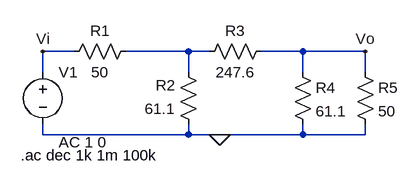
[diagram p0: schematic ej1.asc]
ej1.asc, the LTspice schematic file:
Version 4
SHEET 1 880 680
WIRE 48 64 0 64
WIRE 224 64 128 64
WIRE 256 64 224 64
WIRE 400 64 336 64
WIRE 496 64 400 64
WIRE 0 96 0 64
WIRE 224 96 224 64
WIRE 400 96 400 64
WIRE 496 96 496 64
WIRE 0 192 0 176
WIRE 224 192 224 176
WIRE 224 192 0 192
WIRE 272 192 224 192
WIRE 400 192 400 176
WIRE 400 192 272 192
WIRE 496 192 496 176
WIRE 496 192 400 192
FLAG 272 192 0
FLAG 496 64 Vo
FLAG 0 64 Vi
SYMBOL voltage 0 80 R0
WINDOW 123 24 124 Left 2
WINDOW 39 0 0 Left 0
SYMATTR InstName V1
SYMATTR Value ""
SYMATTR Value2 AC 1 0
SYMBOL res 144 48 R90
WINDOW 0 0 56 VBottom 2
WINDOW 3 32 56 VTop 2
SYMATTR InstName R1
SYMATTR Value 50
SYMBOL res 240 192 R180
WINDOW 0 36 76 Left 2
WINDOW 3 36 40 Left 2
SYMATTR InstName R2
SYMATTR Value 61.1
SYMBOL res 240 80 R270
WINDOW 0 32 56 VTop 2
WINDOW 3 0 56 VBottom 2
SYMATTR InstName R3
SYMATTR Value 247.6
SYMBOL res 384 80 R0
SYMATTR InstName R4
SYMATTR Value 61.1
SYMBOL res 480 80 R0
SYMATTR InstName R5
SYMATTR Value 50
TEXT -34 224 Left 2 !.ac dec 1k 1m 100k

The netlist it stands for:
* ej1.asc
V1 Vi 0 AC 1 0
R1 N001 Vi 50
R2 0 N001 61.1
R3 N001 Vo 247.6
R4 Vo 0 61.1
R5 Vo 0 50
.ac dec 1k 1m 100k
.backanno
.end